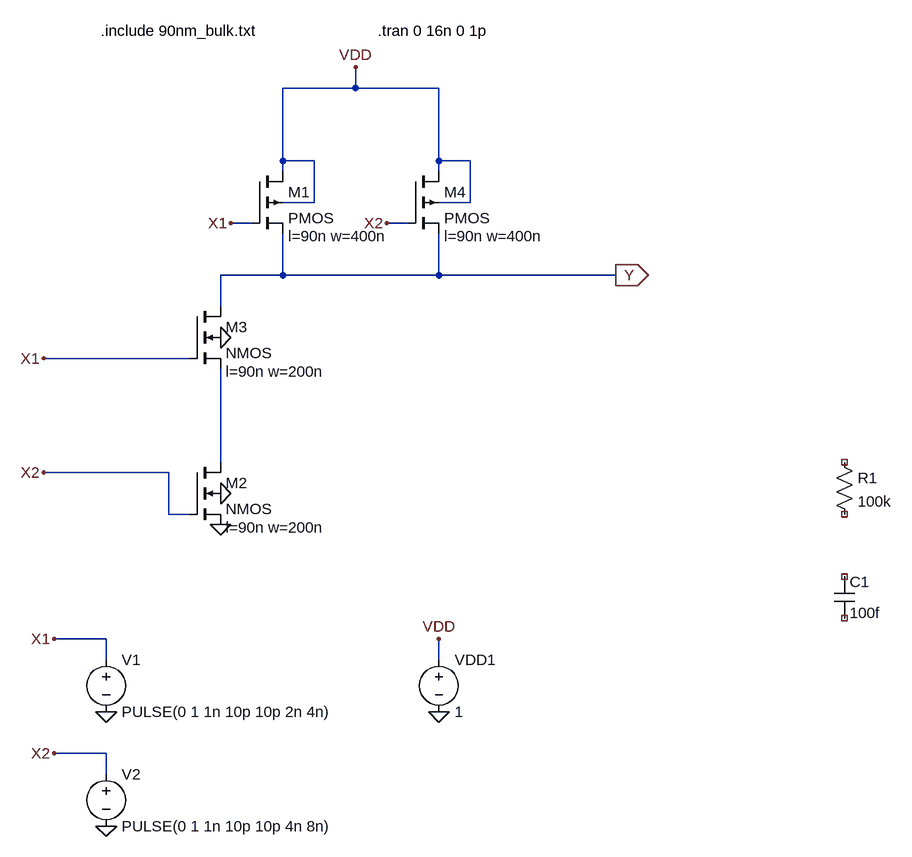
[diagram p0: schematic nand-test.asc]
nand-test.asc, the LTspice schematic file:
Version 4
SHEET 1 1264 680
WIRE 432 -688 432 -720
WIRE 432 -688 320 -688
WIRE 560 -688 432 -688
WIRE 320 -576 320 -688
WIRE 368 -576 320 -576
WIRE 560 -576 560 -688
WIRE 608 -576 560 -576
WIRE 320 -560 320 -576
WIRE 560 -560 560 -576
WIRE 368 -512 368 -576
WIRE 368 -512 320 -512
WIRE 608 -512 608 -576
WIRE 608 -512 560 -512
WIRE 272 -480 240 -480
WIRE 512 -480 480 -480
WIRE 320 -400 320 -464
WIRE 320 -400 224 -400
WIRE 560 -400 560 -464
WIRE 560 -400 320 -400
WIRE 832 -400 560 -400
WIRE 224 -352 224 -400
WIRE 176 -272 -48 -272
WIRE 224 -112 224 -256
WIRE 144 -96 -48 -96
WIRE 144 -32 144 -96
WIRE 176 -32 144 -32
WIRE 48 160 -32 160
WIRE 48 192 48 160
WIRE 560 192 560 160
WIRE 48 336 -32 336
WIRE 48 368 48 336
FLAG 48 272 0
FLAG 48 448 0
FLAG -32 160 X1
FLAG -32 336 X2
FLAG -48 -272 X1
FLAG -48 -96 X2
FLAG 560 272 0
FLAG 560 160 VDD
FLAG 224 -16 0
FLAG 224 -64 0
FLAG 432 -720 VDD
FLAG 240 -480 X1
FLAG 480 -480 X2
FLAG 832 -400 Y
IOPIN 832 -400 Out
FLAG 224 -304 0
SYMBOL voltage 48 176 R0
WINDOW 123 0 0 Left 0
WINDOW 39 0 0 Left 0
SYMATTR InstName V1
SYMATTR Value PULSE(0 1 1n 10p 10p 2n 4n)
SYMBOL voltage 560 176 R0
WINDOW 123 0 0 Left 0
WINDOW 39 0 0 Left 0
SYMATTR InstName VDD1
SYMATTR Value 1
SYMBOL pmos4 272 -560 R0
WINDOW 123 56 100 Left 2
SYMATTR Value2 l=90n w=400n
SYMATTR InstName M1
SYMBOL nmos4 176 -112 R0
WINDOW 123 56 100 Left 2
SYMATTR Value2 l=90n w=200n
SYMATTR InstName M2
SYMBOL voltage 48 352 R0
WINDOW 123 0 0 Left 0
WINDOW 39 0 0 Left 0
SYMATTR InstName V2
SYMATTR Value PULSE(0 1 1n 10p 10p 4n 8n)
SYMBOL res 1168 -128 R0
SYMATTR InstName R1
SYMATTR Value 100k
SYMBOL cap 1168 64 R0
SYMATTR InstName C1
SYMATTR Value 100f
SYMBOL nmos4 176 -352 R0
WINDOW 123 56 100 Left 2
SYMATTR Value2 l=90n w=200n
SYMATTR InstName M3
SYMBOL pmos4 512 -560 R0
WINDOW 123 56 100 Left 2
SYMATTR Value2 l=90n w=400n
SYMATTR InstName M4
TEXT 40 -776 Left 2 !.include 90nm_bulk.txt
TEXT 466 -776 Left 2 !.tran 0 16n 0 1p

The netlist it stands for:
* nand-test.asc
V1 X1 0 PULSE(0 1 1n 10p 10p 2n 4n)
VDD1 VDD 0 1
M1 VDD X1 Y VDD PMOS l=90n w=400n
M2 N001 X2 0 0 NMOS l=90n w=200n
V2 X2 0 PULSE(0 1 1n 10p 10p 4n 8n)
R1 NC_01 NC_02 100k
C1 NC_03 NC_04 100f
M3 Y X1 N001 0 NMOS l=90n w=200n
M4 VDD X2 Y VDD PMOS l=90n w=400n
.model NMOS NMOS
.model PMOS PMOS
.lib standard.mos
.include 90nm_bulk.txt
.tran 0 16n 0 1p
.backanno
.end